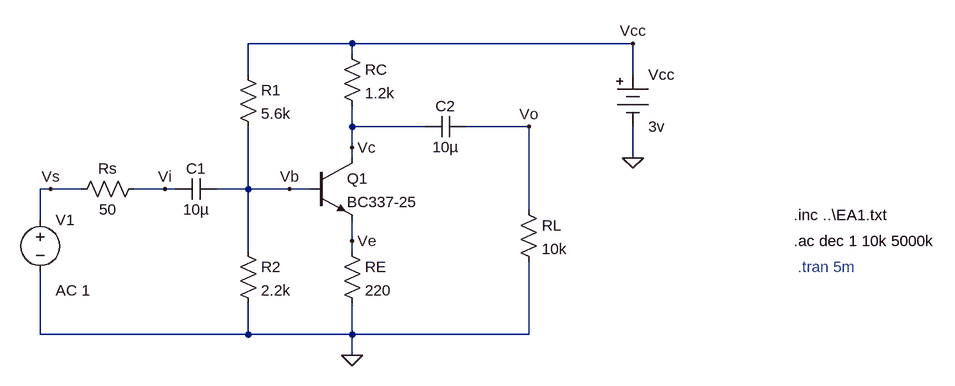
[diagram p0: schematic Circuito TP1.asc]
Circuito TP1.asc, the LTspice schematic file:
Version 4
SHEET 1 932 680
WIRE 16 -112 -144 -112
WIRE 448 -112 16 -112
WIRE 16 -96 16 -112
WIRE -144 -64 -144 -112
WIRE 448 -64 448 -112
WIRE 16 16 16 -16
WIRE 128 16 16 16
WIRE 288 16 192 16
WIRE 16 48 16 16
WIRE 16 64 16 48
WIRE 448 64 448 16
WIRE -448 112 -464 112
WIRE -400 112 -448 112
WIRE -272 112 -320 112
WIRE -256 112 -272 112
WIRE -144 112 -144 16
WIRE -144 112 -192 112
WIRE -80 112 -144 112
WIRE -48 112 -80 112
WIRE 288 144 288 16
WIRE -464 160 -464 112
WIRE 16 192 16 160
WIRE -144 208 -144 112
WIRE 16 208 16 192
WIRE -464 336 -464 240
WIRE -144 336 -144 288
WIRE -144 336 -464 336
WIRE 16 336 16 288
WIRE 16 336 -144 336
WIRE 288 336 288 224
WIRE 288 336 16 336
WIRE 16 368 16 336
FLAG 16 368 0
FLAG 448 64 0
FLAG 16 48 Vc
FLAG -80 112 Vb
FLAG 16 192 Ve
FLAG 448 -112 Vcc
FLAG 288 16 Vo
FLAG -272 112 Vi
FLAG -448 112 Vs
SYMBOL npn -48 64 R0
SYMATTR InstName Q1
SYMATTR Value BC337-25
SYMBOL res 0 -112 R0
SYMATTR InstName RC
SYMATTR Value 1.2k
SYMBOL res -160 -80 R0
SYMATTR InstName R1
SYMATTR Value 5.6k
SYMBOL res 0 192 R0
SYMATTR InstName RE
SYMATTR Value 220
SYMBOL Misc\\battery 448 -80 R0
WINDOW 123 0 0 Left 0
WINDOW 39 0 0 Left 0
SYMATTR InstName Vcc
SYMATTR Value 3v
SYMBOL res -160 192 R0
SYMATTR InstName R2
SYMATTR Value 2.2k
SYMBOL voltage -464 144 R0
WINDOW 123 24 124 Left 2
WINDOW 39 0 0 Left 0
SYMATTR Value2 AC 1
SYMATTR InstName V1
SYMATTR Value ""
SYMBOL res -304 96 R90
WINDOW 0 0 56 VBottom 2
WINDOW 3 32 56 VTop 2
SYMATTR InstName Rs
SYMATTR Value 50
SYMBOL cap -192 96 R90
WINDOW 0 0 32 VBottom 2
WINDOW 3 32 32 VTop 2
SYMATTR InstName C1
SYMATTR Value 10µ
SYMBOL cap 192 0 R90
WINDOW 0 0 32 VBottom 2
WINDOW 3 32 32 VTop 2
SYMATTR InstName C2
SYMATTR Value 10µ
SYMBOL res 272 128 R0
SYMATTR InstName RL
SYMATTR Value 10k
TEXT 696 152 Left 2 !.inc ..\\EA1.txt
TEXT 696 192 Left 2 !.ac dec 1 10k 5000k
TEXT 702 232 Left 2 ;.tran 5m

The netlist it stands for:
* Circuito TP1.asc
Q1 Vc Vb Ve 0 BC337-25
RC Vcc Vc 1.2k
R1 Vcc Vb 5.6k
RE Ve 0 220
Vcc Vcc 0 3v
R2 Vb 0 2.2k
V1 Vs 0 AC 1
Rs Vi Vs 50
C1 Vb Vi 10µ
C2 Vo Vc 10µ
RL Vo 0 10k
.model NPN NPN
.model PNP PNP
.lib standard.bjt
.inc ..\EA1.txt
.ac dec 1 10k 5000k
* .tran 5m
.backanno
.end